# Altium schematic sheet 03_02_MCU_STM32F103.SchDoc
size A4; SheetNumber: 4; SheetTotal: 6
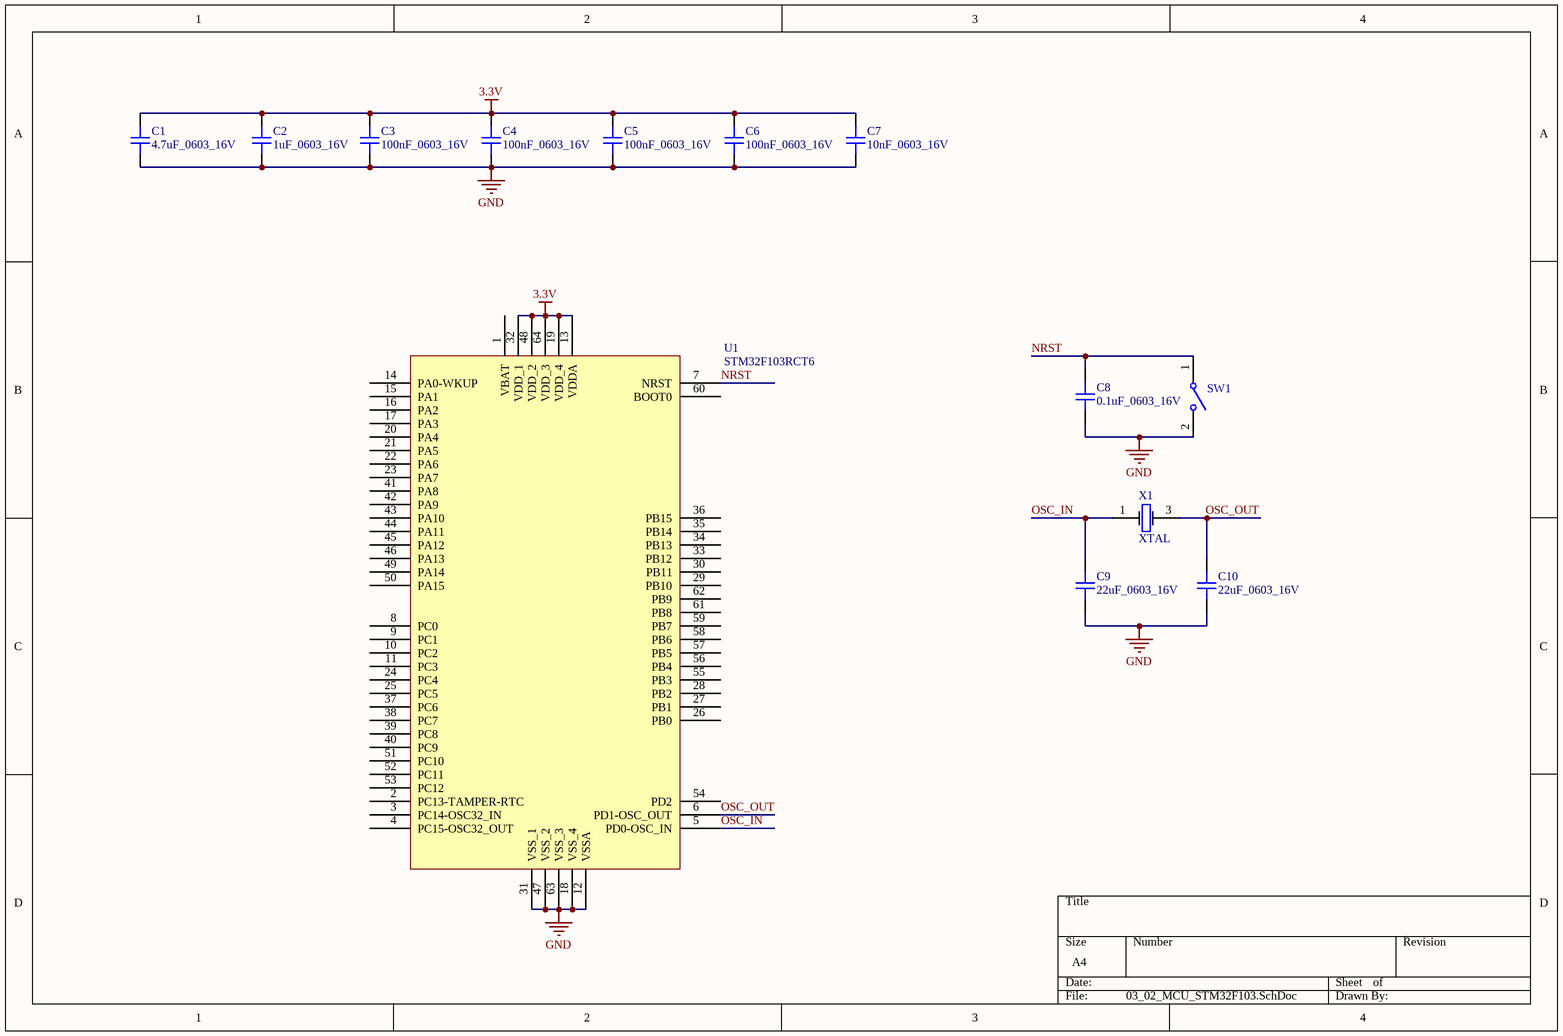
[diagram p0: 03_02_MCU_STM32F103.SchDoc]

## Parts
C1  4.7uF_0603_16V  [CAP_0603]
C2  1uF_0603_16V  [CAP_0603]
C3  100nF_0603_16V  [CAP_0603]
C4  100nF_0603_16V  [CAP_0603]
C5  100nF_0603_16V  [CAP_0603]
C6  100nF_0603_16V  [CAP_0603]
C7  10nF_0603_16V  [CAP_0603]
C8  0.1uF_0603_16V  [CAP_0603]
C9  22uF_0603_16V  [CAP_0603]
C10  22uF_0603_16V  [CAP_0603]
SW1  434121025816  [WS-TASV_L6W3.8H2.5_4341x10258x6]  (value not drawn)
U1  STM32F103RCT6  [STM32F103RCT6]
X1  XTAL  [XTAL 3225]

## Nets
3.3V: C1.2 C2.2 C3.2 C4.2 C5.2 C6.2 C7.2 U1.13(VDDA) U1.19(VDD_4) U1.32(VDD_1) U1.48(VDD_2) U1.64(VDD_3)
GND: C1.1 C2.1 C3.1 C4.1 C5.1 C6.1 C7.1 C8.1 C9.1 C10.1 SW1.2 U1.12(VSSA) U1.18(VSS_4) U1.31(VSS_1) U1.47(VSS_2) U1.63(VSS_3)
NRST: C8.2 SW1.1 U1.7(NRST)
OSC_IN: C9.2 U1.5(PD0-OSC_IN) X1.1
OSC_OUT: C10.2 U1.6(PD1-OSC_OUT) X1.3

Not connected (* = marked no-connect by the designer): U1 1(VBAT) 2(PC13-TAMPER-RTC) 3(PC14-OSC32_IN) 4(PC15-OSC32_OUT) 8(PC0) 9(PC1) 10(PC2) 11(PC3) 14(PA0-WKUP) 15(PA1) 16(PA2) 17(PA3) 20(PA4) 21(PA5) 22(PA6) 23(PA7) 24(PC4) 25(PC5) 26(PB0) 27(PB1) 28(PB2) 29(PB10) 30(PB11) 33(PB12) 34(PB13) 35(PB14) 36(PB15) 37(PC6) 38(PC7) 39(PC8) 40(PC9) 41(PA8) 42(PA9) 43(PA10) 44(PA11) 45(PA12) 46(PA13) 49(PA14) 50(PA15) 51(PC10) 52(PC11) 53(PC12) 54(PD2) 55(PB3) 56(PB4) 57(PB5) 58(PB6) 59(PB7) 60(BOOT0) 61(PB8) 62(PB9)

## Library data of the parts
C1-C10 = CAP_0603_16V: Capacitor SMD 0603 16V
SW1 = 434121025816: WS-TASV SMT Tact Switch, 12VDC, 50mA, 160g, height 2.5mm; Manufacturer: Wurth Elektronik; Rated Voltage: 12V; Washable: No; Actuator Color: Black; Electrical Life: 30000Cycles; ComponentLink1Description: Manufacturer Link; ComponentLink1URL: http://www.we-online.de; ComponentLink2Description: Datasheet; ComponentLink2URL: https://www.we-online.com/catalog/datasheet/434121025816.pdf; Manufacturer Part Number: 434121025816; Contact Material: Stainless Steel; Mounting Technology: SMT; Contact Plating: Silver; Operation Force: 160g; Packaging: Tape and Reel; Terminal Material: Copper Alloy; Rated Current: 50mA; Terminal Plating: Silver; Height: 2.5mm; Length: 6mm; Operating Temperature max.: 85C; Operating Temperature min.: -40C; Width: 3.8mm
U1 = STM32F103RCT6: High-density performance line Arm®-based 32-bit MCU with 256KB Flash, CAN, I2C, IrDA, LIN, SPI, UART/USART, USB.; Mfr: STMicroelectronics; Core Processor: ARM® Cortex®-M3; Core Size: 32-Bit Single-Core; Speed: 72MHz; Connectivity: CANbus, I²C, IrDA, LINbus, SPI, UART/USART, USB; Peripherals: DMA, Motor Control PWM, PDR, POR, PVD, PWM, Temp Sensor, WDT; Number of I/O: 51; Program Memory Size: 256KB (256K x 8); RAM Size: 48K x 8; Voltage - Supply (Vcc/Vdd): 2V ~ 3.6V; Data Converters: A/D 16x12b; D/A 2x12b; Oscillator Type: Internal; Program Memory Type: FLASH; Operating Temperature: -40°C ~ 85°C (TA); Mounting Type: Surface Mount; Package / Case: 64-LQFP
X1 = XTAL: Value: 16MHz